# EAGLE schematic cpu_board (EAGLE 7.5.0)
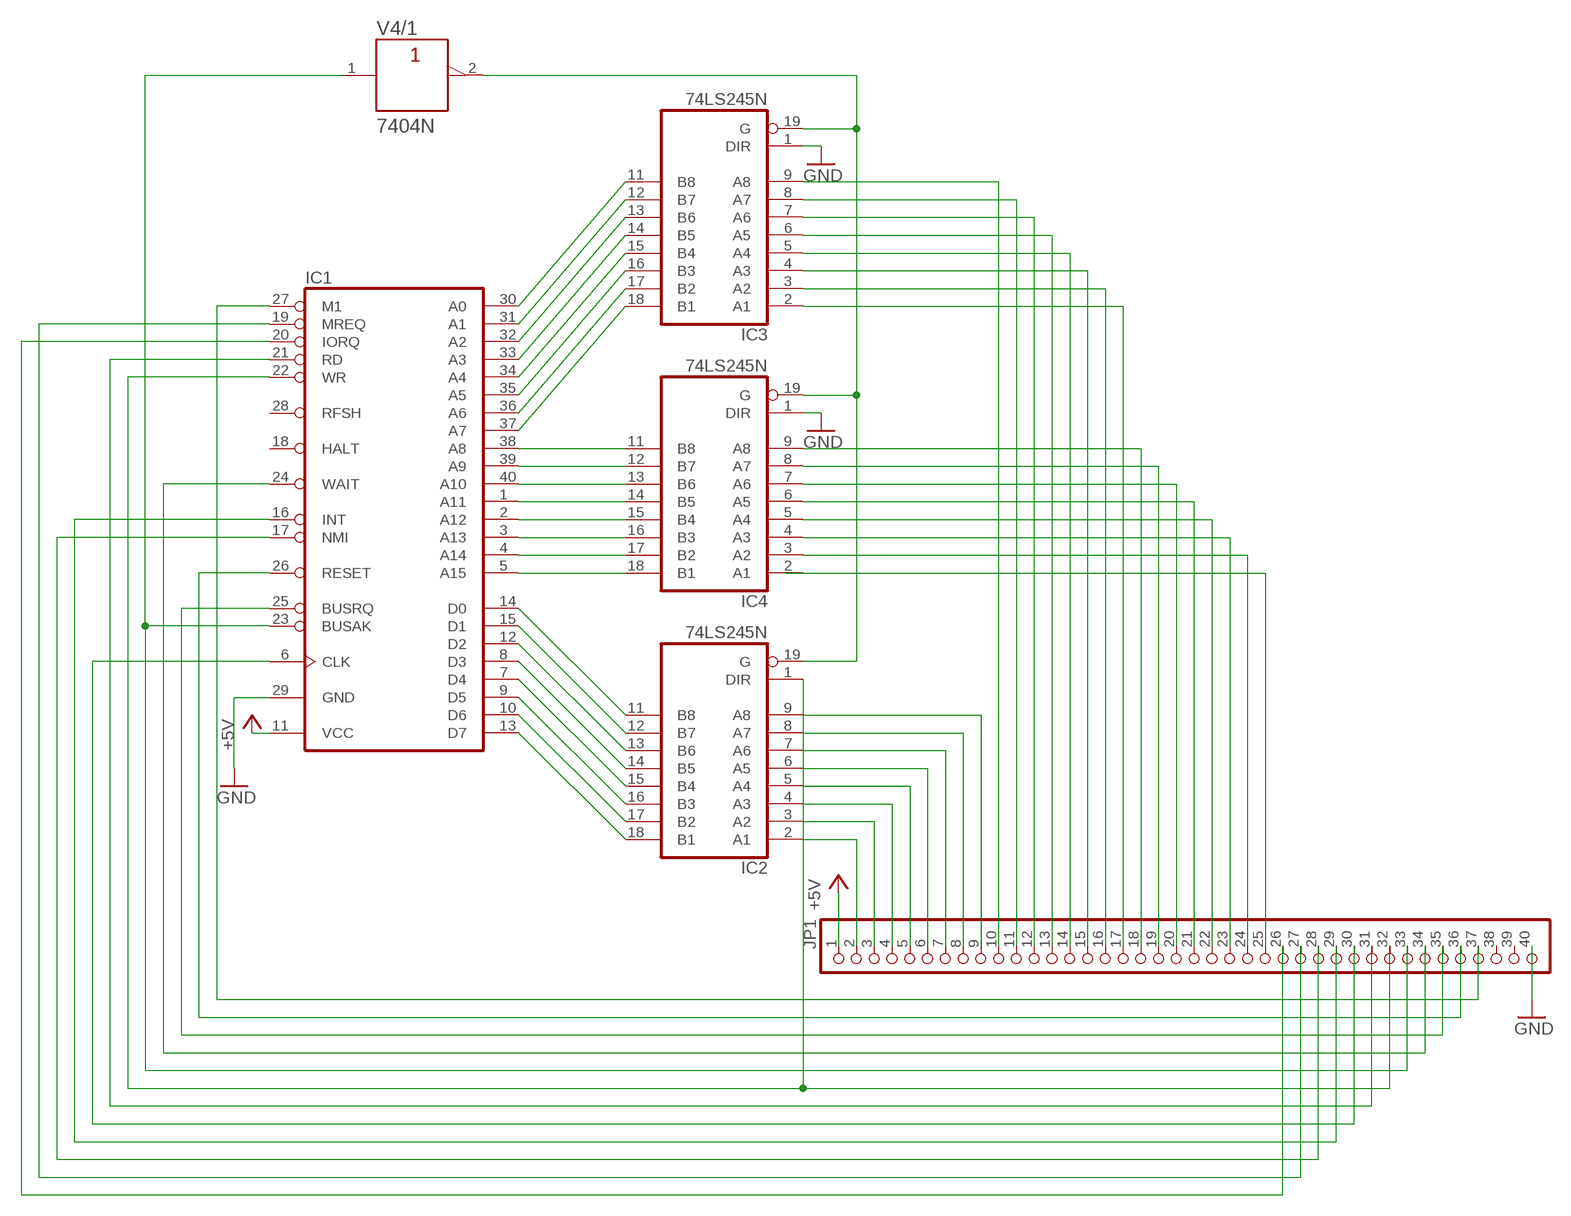
[diagram p0: schematic, sheet 1]

## Parts
IC1  Z80CPU  [DIL40]
IC2  74LS245N  [DIL20]
IC3  74LS245N  [DIL20]
IC4  74LS245N  [DIL20]
JP1  PINHD-1X40  [1X40]
V4  7404N  [DIL14]

## Nets
+5V: IC1.11(VCC) JP1.1
GND: IC1.29(GND) IC3.1(DIR) IC4.1(DIR) JP1.40
N$1: IC1.14(D0) IC2.11(B8)
N$2: IC1.15(D1) IC2.12(B7)
N$3: IC1.12(D2) IC2.13(B6)
N$4: IC1.8(D3) IC2.14(B5)
N$5: IC1.7(D4) IC2.15(B4)
N$6: IC1.9(D5) IC2.16(B3)
N$7: IC1.10(D6) IC2.17(B2)
N$8: IC1.13(D7) IC2.18(B1)
N$9: IC2.2(A1) JP1.2
N$10: IC2.3(A2) JP1.3
N$11: IC2.4(A3) JP1.4
N$12: IC2.5(A4) JP1.5
N$13: IC2.6(A5) JP1.6
N$14: IC2.7(A6) JP1.7
N$15: IC2.8(A7) JP1.8
N$16: IC2.9(A8) JP1.9
N$17: IC1.30(A0) IC3.11(B8)
N$18: IC1.31(A1) IC3.12(B7)
N$19: IC1.32(A2) IC3.13(B6)
N$20: IC1.33(A3) IC3.14(B5)
N$21: IC1.34(A4) IC3.15(B4)
N$22: IC1.35(A5) IC3.16(B3)
N$23: IC1.36(A6) IC3.17(B2)
N$24: IC1.37(A7) IC3.18(B1)
N$25: IC1.38(A8) IC4.11(B8)
N$26: IC1.39(A9) IC4.12(B7)
N$27: IC1.40(A10) IC4.13(B6)
N$28: IC1.1(A11) IC4.14(B5)
N$29: IC1.2(A12) IC4.15(B4)
N$30: IC1.3(A13) IC4.16(B3)
N$31: IC1.4(A14) IC4.17(B2)
N$32: IC1.5(A15) IC4.18(B1)
N$33: IC3.9(A8) JP1.10
N$34: IC3.8(A7) JP1.11
N$35: IC3.7(A6) JP1.12
N$36: IC3.6(A5) JP1.13
N$37: IC3.5(A4) JP1.14
N$38: IC3.4(A3) JP1.15
N$39: IC3.3(A2) JP1.16
N$40: IC3.2(A1) JP1.17
N$41: IC4.9(A8) JP1.18
N$42: IC4.8(A7) JP1.19
N$43: IC4.7(A6) JP1.20
N$44: IC4.6(A5) JP1.21
N$45: IC4.5(A4) JP1.22
N$46: IC4.4(A3) JP1.23
N$47: IC4.3(A2) JP1.24
N$48: JP1.25
N$49: IC1.20(IORQ) JP1.26
N$50: IC1.19(MREQ) JP1.27
N$51: IC1.17(NMI) JP1.28
N$52: IC1.16(INT) JP1.29
N$53: IC1.6(CLK) JP1.30
N$54: IC1.21(RD) JP1.31
N$55: IC1.22(WR) IC2.1(DIR) JP1.32
N$56: IC1.23(BUSAK) JP1.33 V4.1(/1:A)
N$57: IC1.24(WAIT) JP1.34
N$58: IC1.25(BUSRQ) JP1.35
N$59: IC1.26(RESET) JP1.36
N$60: IC1.27(M1) JP1.37
N$61: IC2.19(G) IC3.19(G) IC4.19(G) V4.2(/1:Y)
Unconnected: IC1.18(HALT) IC1.28(RFSH) IC4.2(A1) JP1.38 JP1.39 V4.3(/2:A) V4.4(/2:Y) V4.5(/3:A) V4.6(/3:Y) V4.8(/4:Y) V4.9(/4:A) V4.10(/5:Y) V4.11(/5:A) V4.12(/6:Y) V4.13(/6:A)

## Power pins joined to a net without a drawn wire
+UB: V4.14(/+UB:+UB)
-UB: V4.7(/-UB:-UB)
GND: IC2.10(GND) IC3.10(GND) IC4.10(GND)
VCC: IC2.20(VCC) IC3.20(VCC) IC4.20(VCC)

## Library data of the parts
IC1 = zilog:Z80CPU: Z80 FAMILY DEVICE
IC2-IC4 = 74xx-us:74*245: Octal BUS TRANSCEIVER, 3-state
JP1 = pinhead:PINHD-1X40: PIN HEADER
V4 = 74ttl-din:74*04: Hex INVERTER